# Altium schematic sheet FMU.SchDoc
size A4
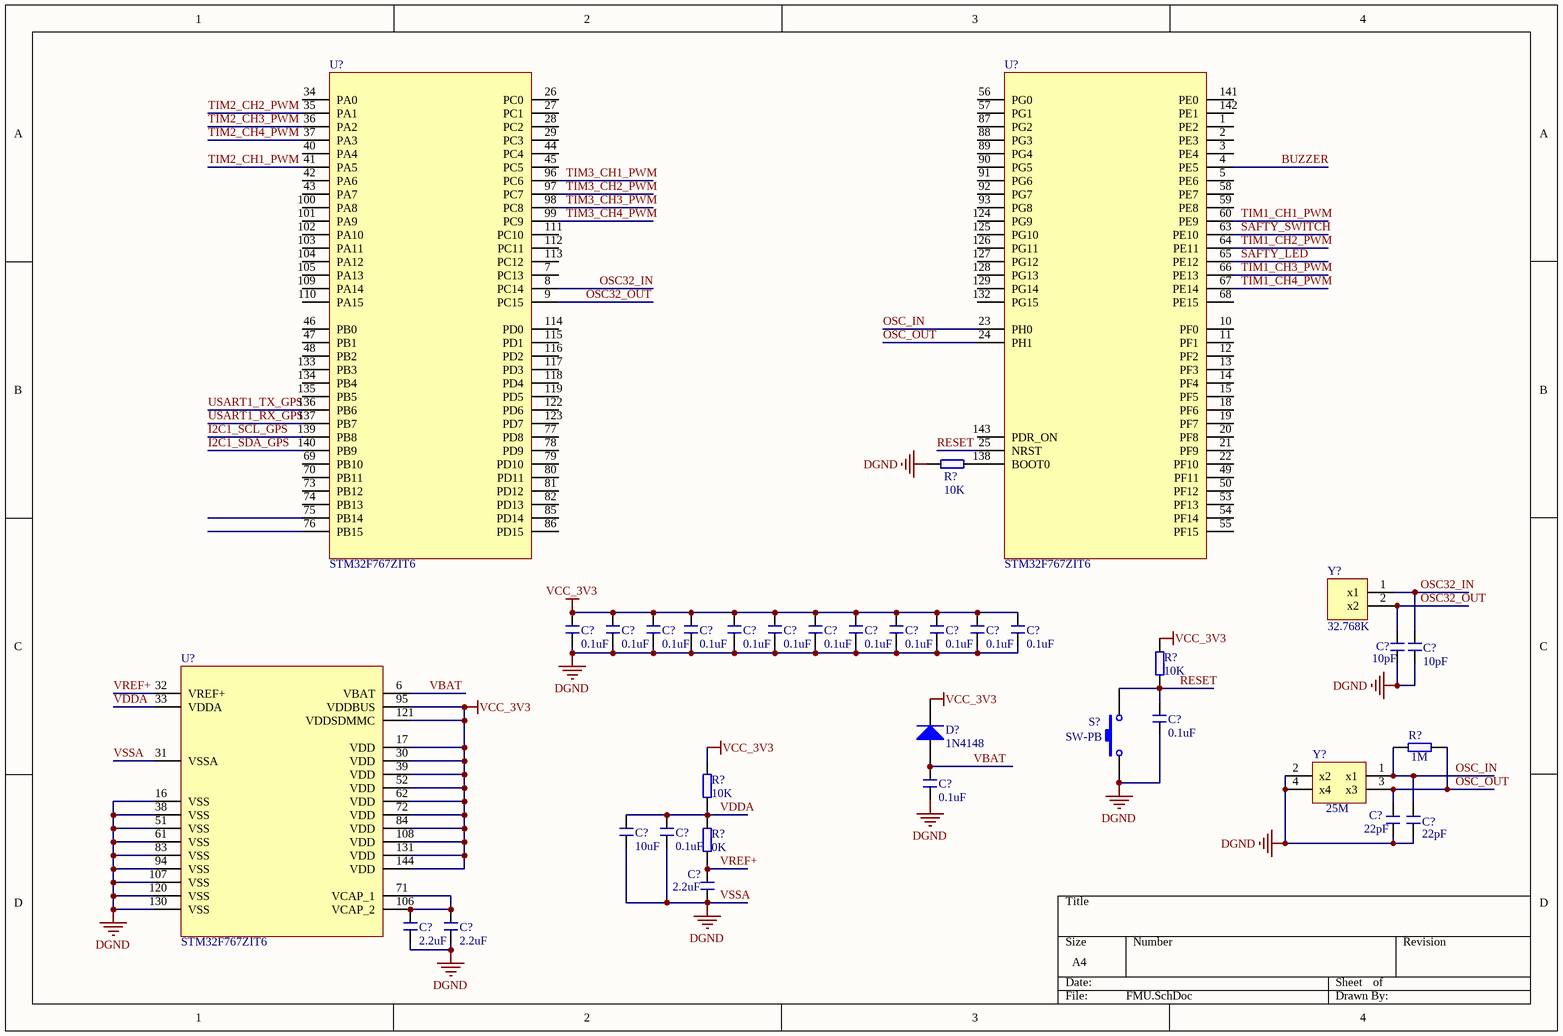
[diagram p0: FMU.SchDoc]

## Parts
(Parts that share a designator on the sheet are numbered #1, #2 ... from top to bottom, then left to right.)
C?#1  value 0.1uF  [C_0402]  (hidden comment: C_0402)
C?#2  value 0.1uF  [C_0402]  (hidden comment: C_0402)
C?#3  value 0.1uF  [C_0402]  (hidden comment: C_0402)
C?#4  value 0.1uF  [C_0402]  (hidden comment: C_0402)
C?#5  value 0.1uF  [C_0402]  (hidden comment: C_0402)
C?#6  value 0.1uF  [C_0402]  (hidden comment: C_0402)
C?#7  value 0.1uF  [C_0402]  (hidden comment: C_0402)
C?#8  value 0.1uF  [C_0402]  (hidden comment: C_0402)
C?#9  value 0.1uF  [C_0402]  (hidden comment: C_0402)
C?#10  value 0.1uF  [C_0402]  (hidden comment: C_0402)
C?#11  value 0.1uF  [C_0402]  (hidden comment: C_0402)
C?#12  value 0.1uF  [C_0402]  (hidden comment: C_0402)
C?#13  value 10pF  [C_0402]  (hidden comment: C_0402)
C?#14  value 10pF  [C_0402]  (hidden comment: C_0402)
C?#15  value 0.1uF  [C_0402]  (hidden comment: C_0402)
C?#16  value 0.1uF  [C_0402]  (hidden comment: C_0402)
C?#17  value 22pF  [C_0402]  (hidden comment: C_0402)
C?#18  value 22pF  [C_0402]  (hidden comment: C_0402)
C?#19  value 10uF  [C_0402]  (hidden comment: C_0402)
C?#20  value 0.1uF  [C_0402]  (hidden comment: C_0402)
C?#21  value 2.2uF  [C_0402]  (hidden comment: C_0402)
C?#22  value 2.2uF  [C_0402]  (hidden comment: C_0402)
C?#23  value 2.2uF  [C_0402]  (hidden comment: C_0402)
D?  1N4148  [DO-35]
R?#1  value 10K  [R_0402]  (hidden comment: R_0402)
R?#2  value 10K  [R_0402]  (hidden comment: R_0402)
R?#3  value 1M  [R_0402]  (hidden comment: R_0402)
R?#4  value 10K  [R_0402]  (hidden comment: R_0402)
R?#5  value 0K  [R_0402]  (hidden comment: R_0402)
S?  SW-PB  [SPST-2]
U?#1  STM32F767ZIT6  [QFP50P2200X2200X160-144N]
U?#2  STM32F767ZIT6  [QFP50P2200X2200X160-144N]
U?#3  STM32F767ZIT6  [QFP50P2200X2200X160-144N]
Y?#1  value 32.768K  [CTAL32768]  (hidden comment: CTAL32768)
Y?#2  value 25M  [CTAL25M]  (hidden comment: CTAL25M)

## Nets
VCC_3V3: C?#1.2 C?#2.2 C?#3.2 C?#4.2 C?#5.2 C?#6.2 C?#7.2 C?#8.2 C?#9.2 C?#10.2 C?#11.2 C?#12.2 D?.2(K) R?#2.1 R?#4.1 U?#3.17(VDD) U?#3.30(VDD) U?#3.39(VDD) U?#3.52(VDD) U?#3.62(VDD) U?#3.72(VDD) U?#3.84(VDD) U?#3.95(VDDBUS) U?#3.108(VDD) U?#3.121(VDDSDMMC) U?#3.131(VDD) U?#3.144(VDD)
VSSA: C?#1.1 C?#2.1 C?#3.1 C?#4.1 C?#5.1 C?#6.1 C?#7.1 C?#8.1 C?#9.1 C?#10.1 C?#11.1 C?#12.1 C?#13.1 C?#14.1 C?#15.1 C?#16.1 C?#17.1 C?#18.1 C?#19.1 C?#20.1 C?#21.1 C?#22.1 C?#23.1 R?#1.2 S?.1 U?#3.16(VSS) U?#3.31(VSSA) U?#3.38(VSS) U?#3.51(VSS) U?#3.61(VSS) U?#3.83(VSS) U?#3.94(VSS) U?#3.107(VSS) U?#3.120(VSS) U?#3.130(VSS) Y?#2.2(x2) Y?#2.4(x4)  [also labelled DGND]
BUZZER: U?#2.4(PE5)
I2C1_SCL_GPS: U?#1.139(PB8)
I2C1_SDA_GPS: U?#1.140(PB9)
OSC32_IN: C?#14.2 U?#1.8(PC14) Y?#1.1(x1)
OSC32_OUT: C?#13.2 U?#1.9(PC15) Y?#1.2(x2)
OSC_IN: C?#18.2 R?#3.2 U?#2.23(PH0) Y?#2.1(x1)
OSC_OUT: C?#17.2 R?#3.1 U?#2.24(PH1) Y?#2.3(x3)
RESET: C?#15.2 R?#2.2 S?.2 U?#2.25(NRST)
SAFTY_LED: U?#2.65(PE12)
SAFTY_SWITCH: U?#2.63(PE10)
TIM1_CH1_PWM: U?#2.60(PE9)
TIM1_CH2_PWM: U?#2.64(PE11)
TIM1_CH3_PWM: U?#2.66(PE13)
TIM1_CH4_PWM: U?#2.67(PE14)
TIM2_CH1_PWM: U?#1.41(PA5)
TIM2_CH2_PWM: U?#1.35(PA1)
TIM2_CH3_PWM: U?#1.36(PA2)
TIM2_CH4_PWM: U?#1.37(PA3)
TIM3_CH1_PWM: U?#1.96(PC6)
TIM3_CH2_PWM: U?#1.97(PC7)
TIM3_CH3_PWM: U?#1.98(PC8)
TIM3_CH4_PWM: U?#1.99(PC9)
USART1_RX_GPS: U?#1.137(PB7)
USART1_TX_GPS: U?#1.136(PB6)
VBAT: C?#16.2 D?.1(A) U?#3.6(VBAT)
VDDA: C?#19.2 C?#20.2 R?#4.2 R?#5.1 U?#3.33(VDDA)
VREF+: C?#21.2 R?#5.2 U?#3.32(VREF+)
NetC?#22_2: C?#22.2 C?#23.2 U?#3.71(VCAP_1) U?#3.106(VCAP_2)
NetR?#1_1: R?#1.1 U?#2.138(BOOT0)

Not connected (* = marked no-connect by the designer): U?#1 7(PC13) 26(PC0) 27(PC1) 28(PC2) 29(PC3) 34(PA0) 40(PA4) 42(PA6) 43(PA7) 44(PC4) 45(PC5) 46(PB0) 47(PB1) 48(PB2) 69(PB10) 70(PB11) 73(PB12) 74(PB13) 75(PB14) 76(PB15) 77(PD8) 78(PD9) 79(PD10) 80(PD11) 81(PD12) 82(PD13) 85(PD14) 86(PD15) 100(PA8) 101(PA9) 102(PA10) 103(PA11) 104(PA12) 105(PA13) 109(PA14) 110(PA15) 111(PC10) 112(PC11) 113(PC12) 114(PD0) 115(PD1) 116(PD2) 117(PD3) 118(PD4) 119(PD5) 122(PD6) 123(PD7) 133(PB3) 134(PB4) 135(PB5); U?#2 1(PE2) 2(PE3) 3(PE4) 5(PE6) 10(PF0) 11(PF1) 12(PF2) 13(PF3) 14(PF4) 15(PF5) 18(PF6) 19(PF7) 20(PF8) 21(PF9) 22(PF10) 49(PF11) 50(PF12) 53(PF13) 54(PF14) 55(PF15) 56(PG0) 57(PG1) 58(PE7) 59(PE8) 68(PE15) 87(PG2) 88(PG3) 89(PG4) 90(PG5) 91(PG6) 92(PG7) 93(PG8) 124(PG9) 125(PG10) 126(PG11) 127(PG12) 128(PG13) 129(PG14) 132(PG15) 141(PE0) 142(PE1) 143(PDR_ON)

## Library data of the parts
C?#1-C?#23 = C_0402: 电容
D? = Diode 1N4148: High Conductance Fast Diode; Published: 8-Jun-2000; LatestRevisionDate: 17-Jul-2002; LatestRevisionNote: Re-released for DXP Platform.; DatasheetVersion: 1997; PackageReference: DO-35; Publisher: Altium Limited; PackageDescription: Diode, Axial; Body 3.8 x 1.9 mm (LxDia. max), Lead Dia. 0.53 mm (max); Code_JEDEC: DO-204-AH; ComponentLink1Description: Manufacturer Link; ComponentLink1URL: http://www.fairchildsemi.com/; ComponentLink2Description: Datasheet; ComponentLink2URL: http://www.fairchildsemi.com/ds/1N%2F1N4148.pdf
R?#1-R?#5 = R_0402: 电阻
S? = SW-PB: Switch; Published: 24-Mar-1999; LatestRevisionDate: 17-Jul-2002; LatestRevisionNote: Re-released for DXP Platform.; PackageReference: SPST-2; Publisher: Altium Limited; PackageDescription: Switch; 2 Leads
U?#1 = U1A
U?#2 = U1B
U?#3 = U1C